# EAGLE schematic shifter_test (EAGLE 6.1)
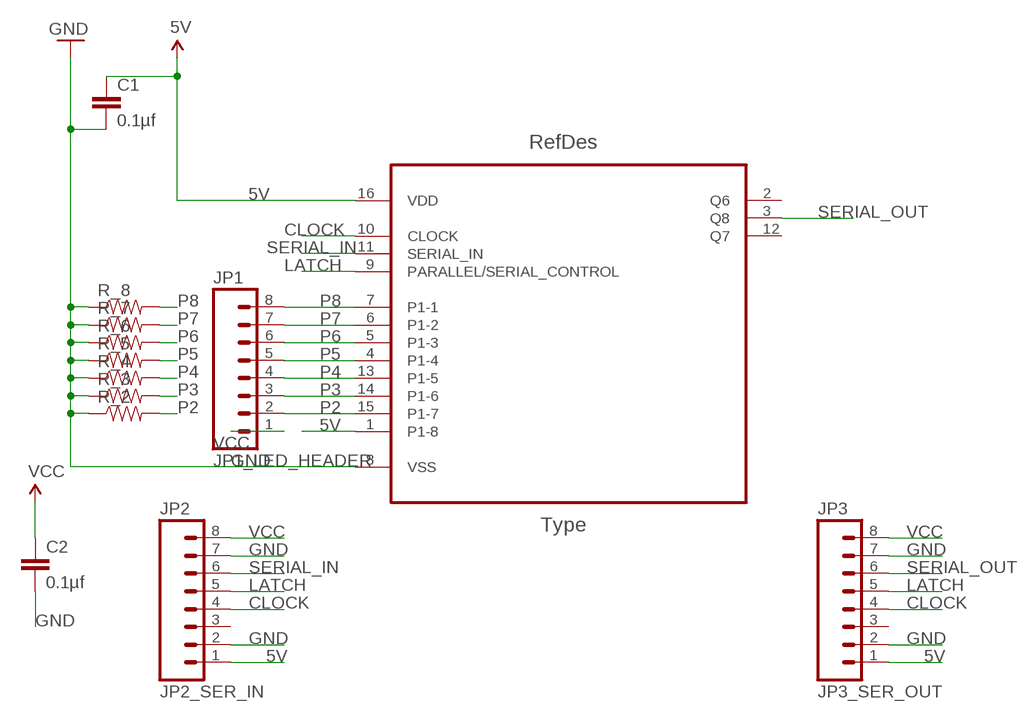
[diagram p0: schematic, sheet 1]

## Parts
C1  0.1µf  CAPPTH2  [CAP-PTH-SMALL2]
C2  0.1µf  CAPPTH2  [CAP-PTH-SMALL2]
JP1  JP1_LED_HEADER  M081X08  [1X08]
JP2  JP2_SER_IN  M081X08  [1X08]
JP3  JP3_SER_OUT  M081X08  [1X08]
R_2  RESISTORAXIAL-0.3  [AXIAL-0.3]
R_3  RESISTORAXIAL-0.3  [AXIAL-0.3]
R_4  RESISTORAXIAL-0.3  [AXIAL-0.3]
R_5  RESISTORAXIAL-0.3  [AXIAL-0.3]
R_6  RESISTORAXIAL-0.3  [AXIAL-0.3]
R_7  RESISTORAXIAL-0.3  [AXIAL-0.3]
R_8  RESISTORAXIAL-0.3  [AXIAL-0.3]
U1  CD4021BE  [DIP254P762X508-16]

## Nets
5V: C1.1 JP2.1 JP3.1 U1.1(P1-8) U1.16(VDD)
CLOCK: JP2.4 JP3.4 U1.10(CLOCK)
GND: C1.2 C2.2 JP2.2 JP2.7 JP3.2 JP3.7 R_2.P$1 R_3.P$1 R_4.P$1 R_5.P$1 R_6.P$1 R_7.P$1 R_8.P$1 U1.8(VSS)
LATCH: JP2.5 JP3.5 U1.9(PARALLEL/SERIAL_CONTROL)
P2: JP1.2 R_2.P$2 U1.15(P1-7)
P3: JP1.3 R_3.P$2 U1.14(P1-6)
P4: JP1.4 R_4.P$2 U1.13(P1-5)
P5: JP1.5 R_5.P$2 U1.4(P1-4)
P6: JP1.6 R_6.P$2 U1.5(P1-3)
P7: JP1.7 R_7.P$2 U1.6(P1-2)
P8: JP1.8 R_8.P$2 U1.7(P1-1)
SERIAL_IN: JP2.6 U1.11(SERIAL_IN)
SERIAL_OUT: JP3.6 U1.3(Q8)
VCC: C2.1 JP1.1 JP2.8 JP3.8
Unconnected: JP2.3 JP3.3 U1.2(Q6) U1.12(Q7)

## Library data of the parts
C1 C2 = SparkFun:CAP: Capacitor Standard 0603 ceramic capacitor, and 0.1" leaded capacitor.
JP1-JP3 = SparkFun:M08: Header 8 Standard 8-pin 0.1" header. Use with straight break away headers (SKU : PRT-00116), right angle break away headers (PRT-00553), swiss pins (PRT-00743), machine pins (PRT-00117), and female headers (PRT-00115).
R_2-R_8 = SparkFun:RESISTOR: Resistor Basic schematic elements and footprints for 0603, 1206, and PTH resistors.
U1 = cd4021be:CD4021BE: CMOS 8-STAGE SHIFT REGISTERS; DESCRIPTION: CMOS 8-STAGE SHIFT REGISTERS; MPN: CD4021BE; OC_FARNELL: -; OC_NEWARK: 60K5104; PACKAGE: PDIP-16; SUPPLIER: Texas Instruments